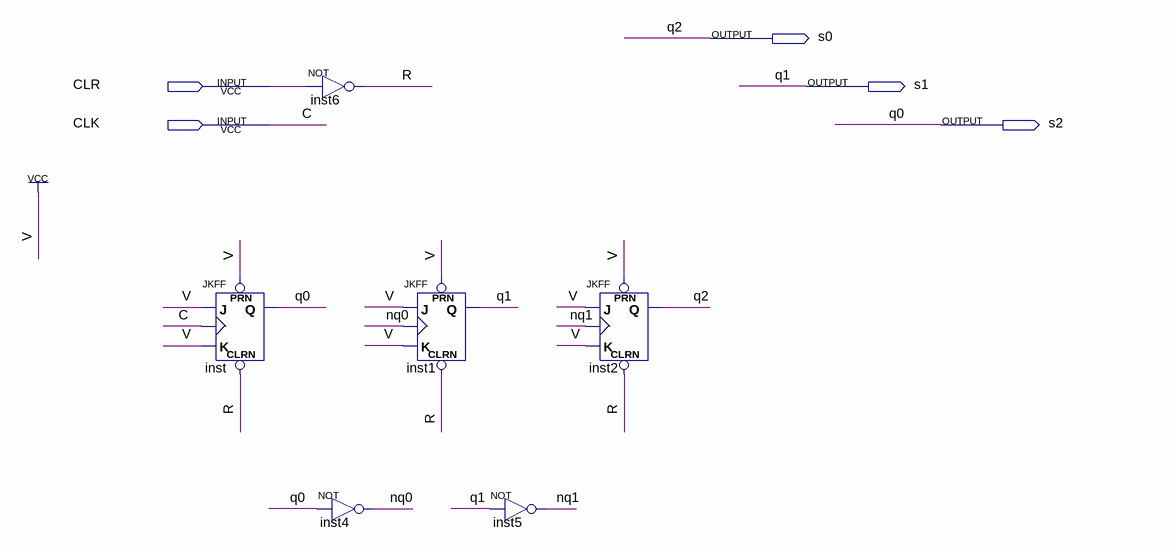
[diagram p0: schematic sheet]
// Quartus schematic Contador_Automatico.bdf as structural Verilog: 6 symbols, 5 pins
module Contador_Automatico (
  input  CLR,
  input  CLK,
  output s0,
  output s1,
  output s2
);

  wire nq0, nq1, R;

  JKFF inst (.PRN(1'b1), .CLRN(R), .K(1'b1), .J(1'b1), .CLK(CLK), .Q(s2));
  not inst6 (R, CLR);
  not inst4 (nq0, s2);
  JKFF inst1 (.PRN(1'b1), .CLRN(R), .K(1'b1), .J(1'b1), .CLK(nq0), .Q(s1));
  not inst5 (nq1, s1);
  JKFF inst2 (.PRN(1'b1), .CLRN(R), .K(1'b1), .J(1'b1), .CLK(nq1), .Q(s0));

  // Other names for the same wires on the sheet: C = CLK; q0 = s2; q1 = s1; q2 = s0
endmodule
